# Altium schematic sheet 电源.SchDoc
size A4; Organization: Altium Limited; Address1: L3, 12a Rodborough Rd; Address2: Frenchs Forest; Address3: NSW; Address4: Australia 2086
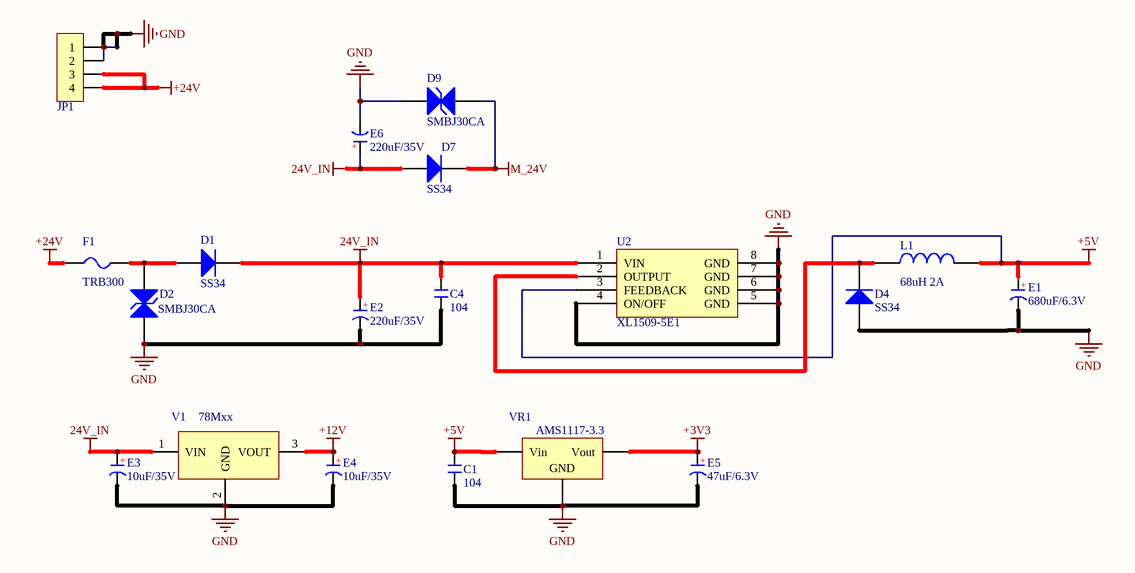
[diagram p0: 电源.SchDoc]

## Parts
C1  104  [C 0603]
C4  104  [C 0603]
D1  SS34  [SMA(DO-214AC)_S1]
D2  SMBJ30CA  [LC-SMA(DO-214AC)_S1]
D4  SS34  [SMA(DO-214AC)_S1]
D7  SS34  [SMA(DO-214AC)_S1]
D9  SMBJ30CA  [LC-SMA(DO-214AC)_S1]
E1  680uF/6.3V  [CM E(8*10.2)]
E2  220uF/35V  [CM E(8*10.2)]
E3  10uF/35V  [CM B(4*5.4)]
E4  10uF/35V  [CM B(4*5.4)]
E5  47uF/6.3V  [CM C(5*5.4)]
E6  220uF/35V  [CM E(8*10.2)]
F1  TRB300  [5.08mm]
JP1  XH-2.54-4P  [XH2.54-4P]  (value not drawn)
L1  68uH 2A  [CDRH74]
U2  XL1509-5E1  [SOP-8_150mil]
V1  78Mxx  [LC-TO-252-2]
VR1  AMS1117-3.3  [SOT-223]

## Nets
24V_IN: C4.2 D1.2(K) D7.1(A) E2.1(A) E3.1(A) E6.1(A) U2.1(VIN) V1.1(VIN)
+3V3: E5.1(A) VR1.2(Vout)
+5V: C1.2 E1.1(A) L1.2 U2.3(FEEDBACK) VR1.3(Vin)
+12V: E4.1(A) V1.3(VOUT)
+24V: F1.1 JP1.3 JP1.4
GND: C1.1 C4.1 D2.1(A) D4.1(A) D9.1(A) E1.2(K) E2.2(K) E3.2(K) E4.2(K) E5.2(K) E6.2(K) JP1.1 JP1.2 U2.4(ON/OFF) U2.5(GND) U2.6(GND) U2.7(GND) U2.8(GND) V1.2(GND) VR1.1(GND)
M_24V: D7.2(K) D9.2(K)
NetD1_1: D1.1(A) D2.2(K) F1.2
NetD4_2: D4.2(K) L1.1 U2.2(OUTPUT)

## Notes on the sheet
- Title
- Size:
- Date:
- A4
- Number:
- Time:
- Revision:
- Sheet
- of
- File:
- (in symbol C-CM) +

## Library data of the parts
C1 C4 = C: 无极性贴片电容; 版权归属: 源创客; BOM名称: 无极性贴片电容; 学习资源: www.ooocke.com
D1 D4 D7 = SMA(DO-214AC) SS54: 二极管; ComponentLink1Description: 供应商链接; ComponentLink1URL: http://www.szlcsc.com/product/details_23178.html; Package: SMA(DO-214AC); Supplier: LC; SuppliersPartNumber: C22452
D2 D9 = SMB/DO-214AA P6SMB6.8CA: TVS; ComponentLink1Description: 供应商链接; ComponentLink1URL: http://www.szlcsc.com/product/details_79530.html; Package: SMB/DO-214AA; Supplier: LC; SuppliersPartNumber: C78395
E1-E6 = C-CM: 贴片电解电容; 版权归属: 源创客; BOM名称: 贴片电解电容; 学习资源: www.ooocke.com
F1 = FU: 直插保险丝; BOM名称: 贴片保险丝; 版权归属: 源创客; 学习资源: www.ooocke.com
JP1 = Header 4: 4P接插件; 版权归属: 源创客; BOM名称: 4P接插件; 学习资源: www.ooocke.com
L1 = INDUCTOR
U2 = XL1509-3.3E1: DC-DC芯片; ComponentLink1Description: 供应商链接; ComponentLink1URL: http://www.szlcsc.com/product/details_62115.html; Package: SOP-8_150mil; Supplier: LC; SuppliersPartNumber: C61063
V1 = 78Mxx: 线性稳压芯片; 版权归属: 源创客; BOM名称: 线性稳压芯片; 学习资源: www.ooocke.com
VR1 = SOT-223 AMS1117-3.3: 低压差线性稳压(LDO); ComponentLink1Description: 供应商链接; ComponentLink1URL: http://www.szlcsc.com/product/details_6652.html; Package: SOT-223; Supplier: LC; SuppliersPartNumber: C6186